# EAGLE design LightSensor (EAGLE 7.2.0)
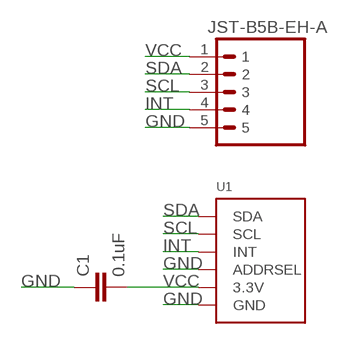
[diagram p0: schematic, sheet 1]

## Parts
C1  0.1uF  0.1UF-25V-5%(0603)  [0603-CAP]
U1  LIGHT_TSL2561  [TSL2561_FN]
U$1  JST-B5B-EH-A  [JST-B5B-ED-A]

## Nets
GND: C1.1 U1.ADR(ADDRSEL) U1.VSS(GND) U$1.5
INT: U1.INT U$1.4
SCL: U1.CLK(SCL) U$1.3
SDA: U1.DATA(SDA) U$1.2
VCC: C1.2 U1.VDD(3.3V) U$1.1

## Library data of the parts
C1 = SparkFun-Capacitors:0.1UF-25V-5%(0603): CAP-08604; PROD_ID: CAP-08604
U1 = duppy_common:LIGHT_TSL2561: TSL2561 Light-To-Digital Sensor Mouser Part Numbers: CS (obsolete): 856-TSL2561CS DFN (cheapest): 856-TSL2561FN
U$1 = duppy_common:JST-B5B-EH-A

## Board
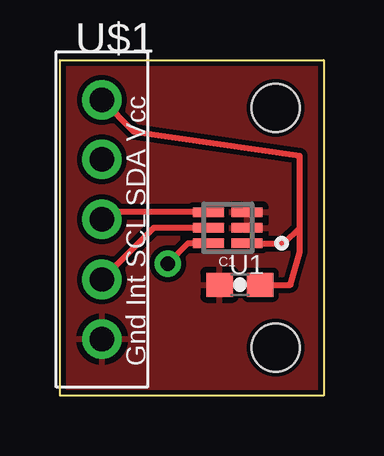
[diagram p1: board, top side]
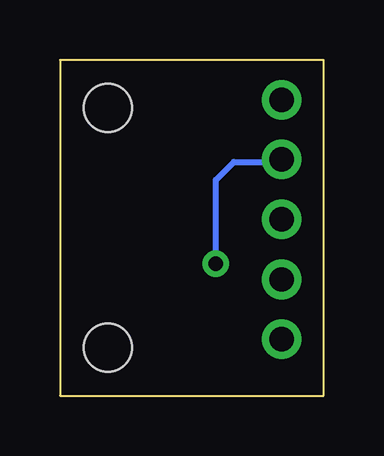
[diagram p2: board, bottom side, seen from below]

Size 11 x 14 mm. Coordinates in mm from the lower left corner, seen from the top.
Outline: 0,0 0,14 11,14 11,0 0,0
Copper layers (1*16): Top 0.035mm / dielectric 1.5mm / Bottom 0.035mm
Design rules "SparkFun": minimum track width 8mil, minimum drill 20mil, track to track 8mil, track to pad 8mil, pad to pad 8mil, via to via 8mil, smd to smd 8mil, copper to edge 8mil, drill to drill 8mil, minimum pad ring 12mil, minimum via ring 10mil, stop-mask expansion 4mil, vias tented up to drill 20mil, thermal gap 10mil
Holes 2 mm at 9,12 9,2

### Footprints (pad centres in the part's own frame; a part is rotated, then mirrored left to right if it is on the bottom)
0603-CAP = smd 1.1 x 1: 1 -0.85,0; 2 0.85,0
TSL2561_FN = smd 1.3 x 0.4: ADR -0.8,0; CLK 0.8,-0.65; DATA 0.8,0.65; INT 0.8,0; VDD -0.8,0.65; VSS -0.8,-0.65
JST-B5B-ED-A = drill 1.016 pad 1.651: 1 1.905,11.989; 2 1.905,9.5; 3 1.905,7.01; 4 1.905,4.496; 5 1.905,2.007

### Placement (x,y rotation side)
C1  7.51,4.62 0 top
U1  7,7 180 top
U$1  -0.15,0.35 0 top

### Tracks (layer width: path | path; a pad name or v marks a point on that pad's centre or on a via)
GND
  pour Top: 0,0 11,0 11,14 0,14
INT
  Top 0.254: U1.INT 3.91,7 U$1.4
SCL
  Top 0.254: U1.CLK 2.04,7.65 U$1.3
SDA  (via drill 0.6)
  Top 0.254: U1.DATA 5.35,6.35 v4.5,5.5
  Bottom 0.254: v4.5,5.5 4.5,9 3.75,9.75 1.85,9.75 U$1.2
VCC
  Top 0.254: U1.VDD 9.35,6.35 10,7 | 10,7 10,10 3.09,11 U$1.1 | C1.2 9.62,4.62 10,6 10,7

### Text on the board
tNames: Gnd Int SCL SDA Vcc